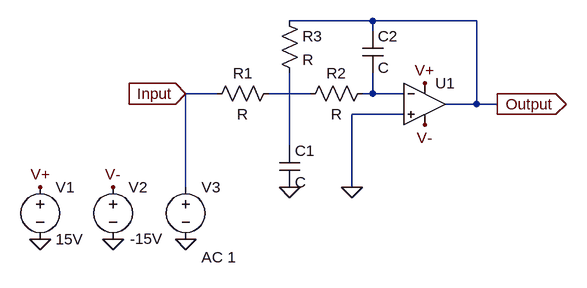
[diagram p0: schematic Draft1.asc]
Draft1.asc, the LTspice schematic file:
Version 4
SHEET 1 908 680
WIRE 576 -48 448 -48
WIRE 736 -48 576 -48
WIRE 576 -32 576 -48
WIRE 336 64 288 64
WIRE 480 64 416 64
WIRE 576 64 576 32
WIRE 576 64 560 64
WIRE 624 64 576 64
WIRE 736 80 736 -48
WIRE 736 80 688 80
WIRE 768 80 736 80
WIRE 624 96 544 96
WIRE 448 144 448 32
WIRE 288 208 288 64
WIRE 544 208 544 96
FLAG 64 288 0
FLAG 176 288 0
FLAG 288 288 0
FLAG 64 208 V+
FLAG 176 208 V-
FLAG 448 208 0
FLAG 544 208 0
FLAG 656 112 V-
FLAG 656 48 V+
FLAG 768 80 Output
IOPIN 768 80 Out
FLAG 288 64 Input
IOPIN 288 64 In
SYMBOL voltage 64 192 R0
SYMATTR InstName V1
SYMATTR Value 15V
SYMBOL voltage 176 192 R0
WINDOW 3 26 95 Left 2
SYMATTR InstName V2
SYMATTR Value -15V
SYMBOL voltage 288 192 R0
WINDOW 123 24 124 Left 2
WINDOW 39 0 0 Left 0
SYMATTR InstName V3
SYMATTR Value ""
SYMATTR Value2 AC 1
SYMBOL res 432 48 R90
WINDOW 0 0 56 VBottom 2
WINDOW 3 32 56 VTop 2
SYMATTR InstName R1
SYMBOL res 576 48 R90
WINDOW 0 0 56 VBottom 2
WINDOW 3 32 56 VTop 2
SYMATTR InstName R2
SYMBOL res 432 -64 R0
SYMATTR InstName R3
SYMBOL cap 432 144 R0
SYMATTR InstName C1
SYMBOL OpAmps\\UniversalOpAmp2 656 80 R0
SYMATTR InstName U1
SYMBOL cap 560 -32 R0
SYMATTR InstName C2

The netlist it stands for:
* Draft1.asc
V1 V+ 0 15V
V2 V- 0 -15V
V3 Input 0 AC 1
R1 N001 Input R
R2 N002 N001 R
R3 Output N003 R
C1 N003 0 C
XU1 0 N002 V+ V- Output level2 Avol=1Meg GBW=10Meg Slew=10Meg Ilimit=25m Rail=0 Vos=0 En=0 Enk=0 In=0 Ink=0 Rin=500Meg  ; pins In+ In- V+ V- OUT
C2 Output N002 C
.lib UniversalOpAmp2.lib
.backanno
.end